# EAGLE design power_node (EAGLE 6.5.0)
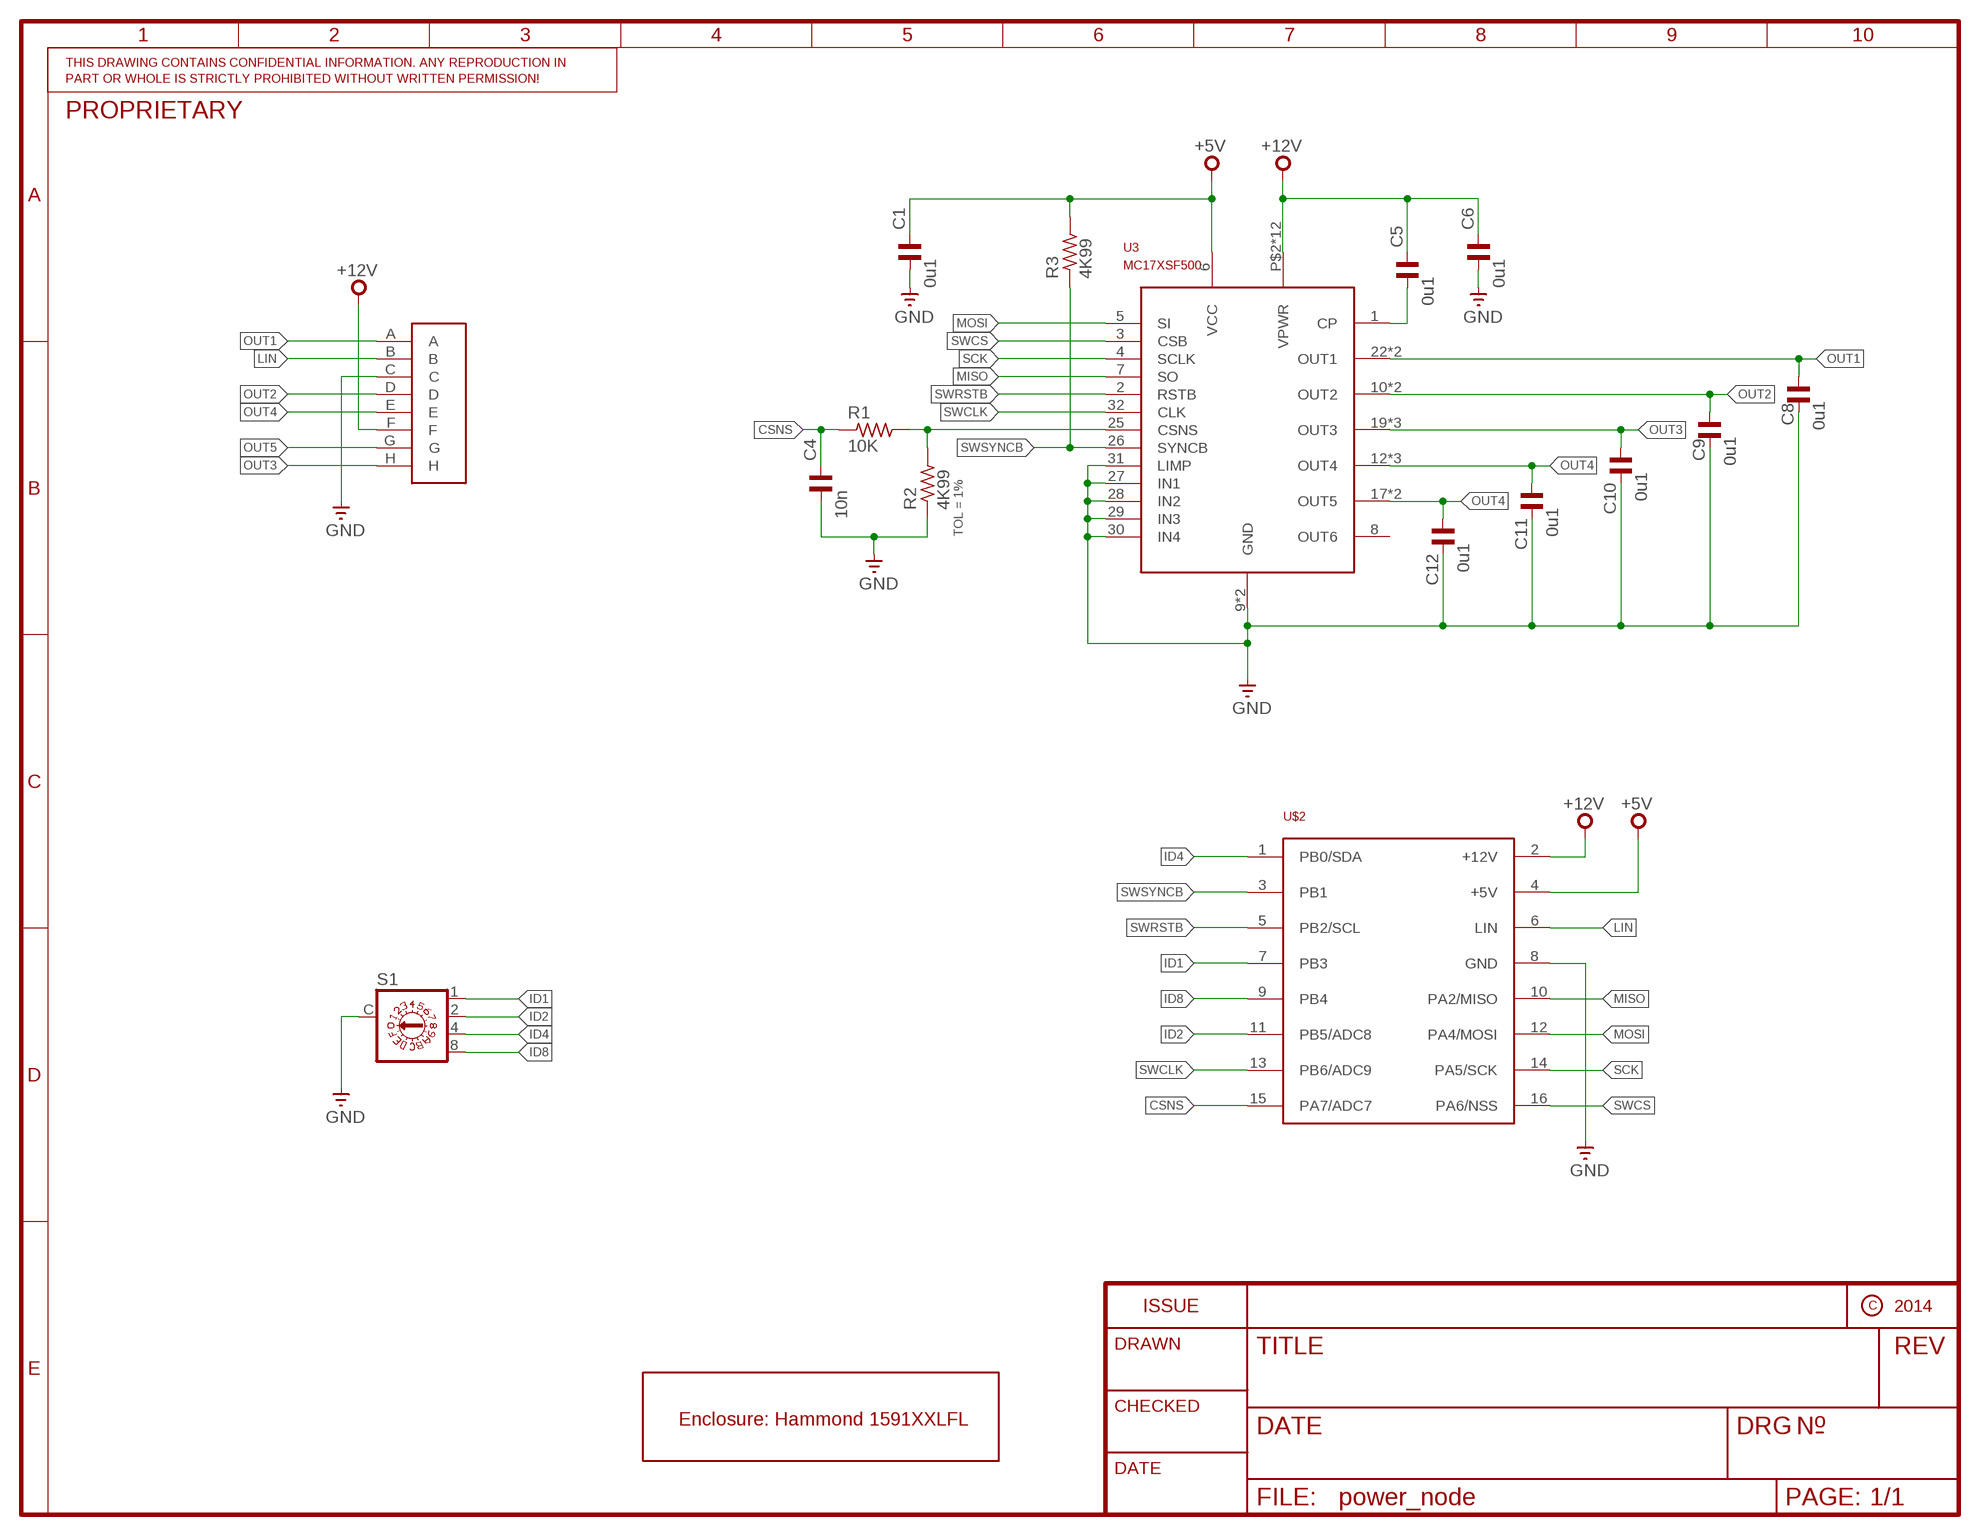
[diagram p0: schematic, sheet 1]

## Parts
C1  0u1  C-EUC0805K  [C0805K]
C4  10n  C-EUC0805K  [C0805K]
C5  0u1  C-EUC0805K  [C0805K]
C6  0u1  C-EUC0805K  [C0805K]
C8  0u1  C-EUC0805K  [C0805K]
C9  0u1  C-EUC0805K  [C0805K]
C10  0u1  C-EUC0805K  [C0805K]
C11  0u1  C-EUC0805K  [C0805K]
C12  0u1  C-EUC0805K  [C0805K]
J2  12146734  [12146734]
R1  10K  R-EU_R0805W  [R0805W]
R2  4K99  R-EU_R0805W  [R0805W]
R3  4K99  R-EU_R0805W  [R0805W]
S1  P103  [P103]
U3  MC17XSF500  [SOIC32W-EP]
U$1  1591XXLFL  [1591XXLFL]
U$2  LIN_NODEHORIZ  [LIN_NODE]

## Nets
+5V [power]: C1.1 R3.2 U3.6(VCC) U$2.4(+5V)
+12V [power]: C5.1 C6.1 J2.F U3.P$2(VPWR) U3.P$3(VPWR) U3.P$4(VPWR) U3.P$5(VPWR) U3.P$6(VPWR) U3.P$7(VPWR) U3.P$8(VPWR) U3.P$9(VPWR) U3.P$10(VPWR) U3.P$11(VPWR) U3.P$12(VPWR) U3.P$13(VPWR) U$2.2(+12V)
CSNS: C4.1 R1.1 U$2.15(PA7/ADC7)
GND [power]: C1.2 C4.2 C6.2 C8.2 C9.2 C10.2 C11.2 C12.2 J2.C R2.1 S1.C U3.9(GND) U3.24(GND) U3.27(IN1) U3.28(IN2) U3.29(IN3) U3.30(IN4) U3.31(LIMP) U$2.8(GND)
ID1: S1.1 U$2.7(PB3)
ID2: S1.2 U$2.11(PB5/ADC8)
ID4: S1.4 U$2.1(PB0/SDA)
ID8: S1.8 U$2.9(PB4)
LIN: J2.B U$2.6(LIN)
MISO: U3.7(SO) U$2.10(PA2/MISO)
MOSI: U3.5(SI) U$2.12(PA4/MOSI)
N$1: C5.2 U3.1(CP)
N$6: R1.2 R2.2 U3.25(CSNS)
OUT1: C8.1 J2.A U3.22(OUT1) U3.23(OUT1)
OUT2: C9.1 J2.D U3.10(OUT2) U3.11(OUT2)
OUT3: C10.1 J2.H U3.19(OUT3) U3.20(OUT3) U3.21(OUT3)
OUT4: C11.1 J2.E U3.12(OUT4) U3.13(OUT4) U3.14(OUT4)
OUT5: C12.1 J2.G U3.17(OUT5) U3.18(OUT5)
SCK: U3.4(SCLK) U$2.14(PA5/SCK)
SWCLK: U3.32(CLK) U$2.13(PB6/ADC9)
SWCS: U3.3(CSB) U$2.16(PA6/NSS)
SWRSTB: U3.2(RSTB) U$2.5(PB2/SCL)
SWSYNCB: R3.1 U3.26(SYNCB) U$2.3(PB1)
Unconnected: U3.8(OUT6)

## Library data of the parts
C1 C5 C6 = custom:C-EU: CAPACITOR, European symbol; PARTNO: FK28X7R1H104K
C4 = custom:C-EU: CAPACITOR, European symbol; PARTNO: FK18X7R1H103K
C8-C12 = custom:C-EU: CAPACITOR, European symbol; PARTNO: C1608X7R1H104M080AA
J2 = custom:12146734; PARTNO: 12146724-B
R1 = custom:R-EU_: RESISTOR, European symbol; PARTNO: CF14JT10K0
R2 = custom:R-EU_: RESISTOR, European symbol; PARTNO: MFR-25FBF52-4K99; TOL: 1%
R3 = custom:R-EU_: RESISTOR, European symbol; PARTNO: MFR-25FBF52-4K99
S1 = custom:P103: DIL/CODE SWITCH; PARTNO: SH-7050MC
U3 = custom:MC17XSF500; PARTNO: MC17XSF500EK
U$1 = custom:1591XXLFL; PARTNO: 1591XXLFLBK
U$2 = custom:LIN_NODE

## Net classes
0 default: width 0.305 mm
1 power: width 0.406 mm

## Board
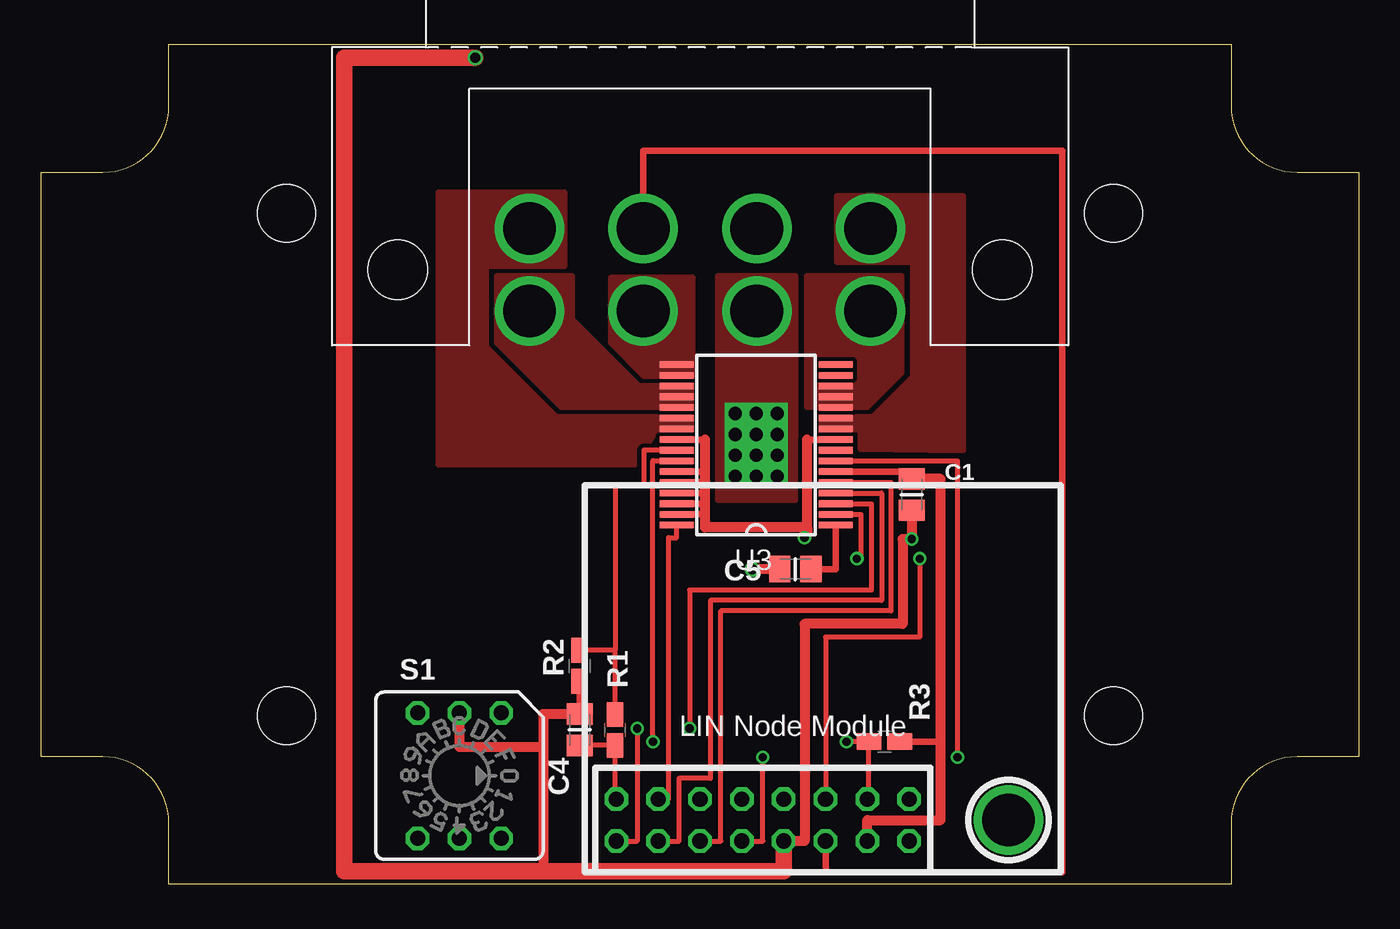
[diagram p1: board, top side]
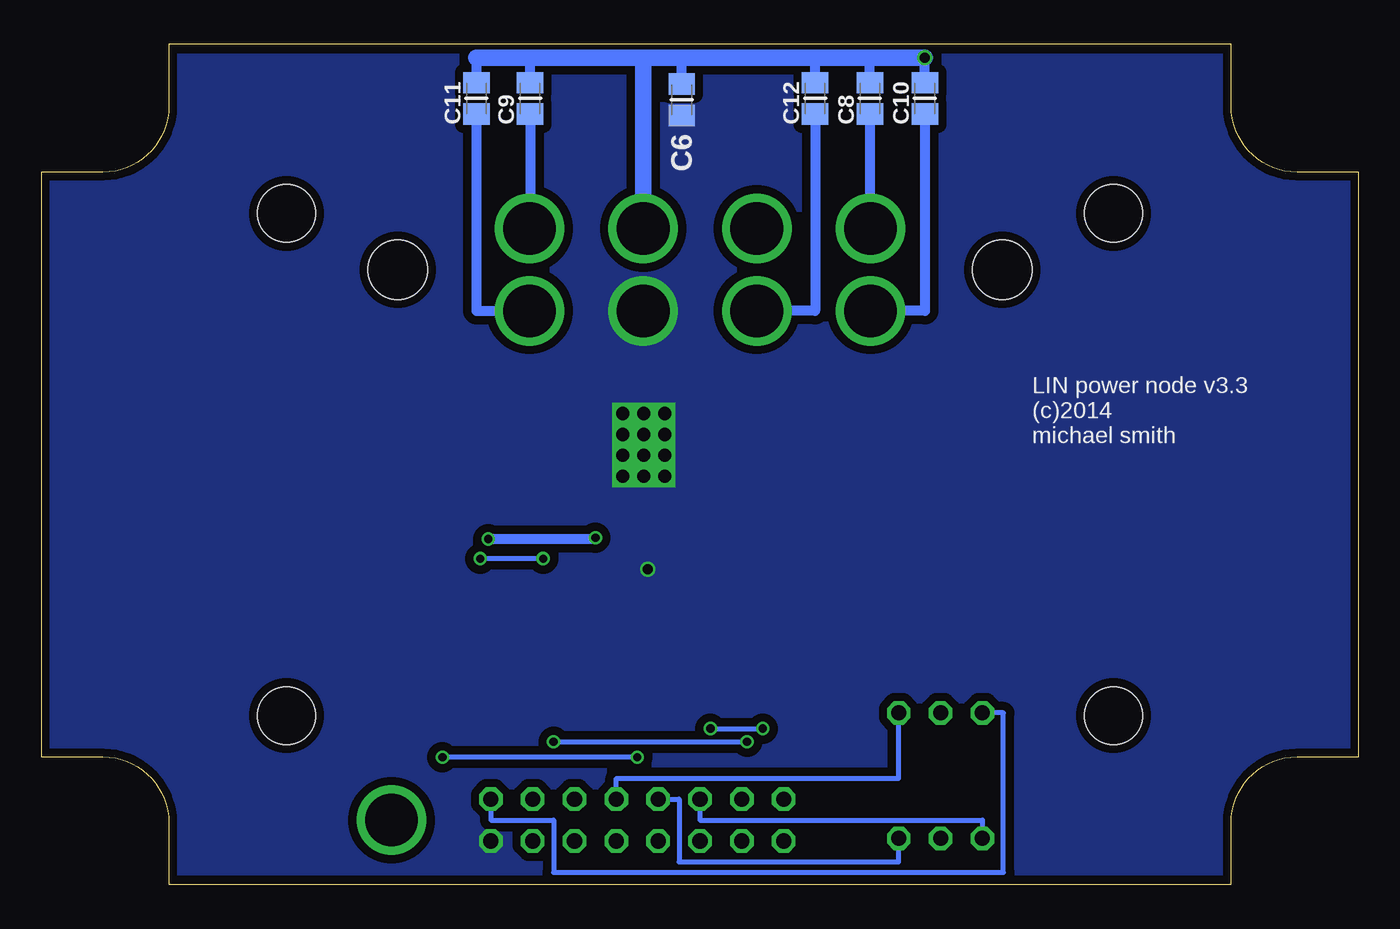
[diagram p2: board, bottom side, seen from below]

Size 80 x 51 mm. Coordinates in mm from the lower left corner, seen from the top.
Copper layers (1*16): Top 0.035mm / dielectric 1.5mm / Bottom 0.035mm
Design rules "dirt_cheap_dirty_boards.v1": minimum track width 5mil, minimum drill 12mil, track to track 5mil, track to pad 5mil, pad to pad 5mil, via to via 5mil, smd to smd 0mil, copper to edge 10mil, drill to drill 10mil, minimum pad ring 10mil, minimum via ring 6mil, stop-mask expansion 2mil, vias tented up to drill 25mil, thermal gap 10mil

### Footprints (pad centres in the part's own frame; a part is rotated, then mirrored left to right if it is on the bottom)
C0805K = smd 1.3 x 1.6: 1 -0.953,0; 2 0.953,0
12146734 = drill 3.2: A 10.35,-2.5; B 3.45,-2.5; C -3.45,-2.5; D -10.35,-2.5; E -10.35,2.5; F -3.45,2.5; G 3.45,2.5; H 10.35,2.5 | hole 3.6: 18.35,0; -18.35,0
R0805W = smd 1.5 x 1: 1 -0.94,0; 2 0.94,0
P103 = drill 0.914 octagon: 1 3.81,-2.54; 2 -3.81,2.54; 4 3.81,2.54; 8 -3.81,-2.54; C 3.81,0; C1 -3.81,0
SOIC32W-EP = smd 2.05 x 0.4: 1 -4.825,4.875; 2 -4.825,4.225; 3 -4.825,3.575; 4 -4.825,2.925; 5 -4.825,2.275; 6 -4.825,1.625; 7 -4.825,0.975; 8 -4.825,0.325; 9 -4.825,-0.325; 10 -4.825,-0.975; 11 -4.825,-1.625; 12 -4.825,-2.275; 13 -4.825,-2.925; 14 -4.825,-3.575; 15 -4.825,-4.225; 16 -4.825,-4.875; 17 4.825,-4.875; 18 4.825,-4.225; 19 4.825,-3.575; 20 4.825,-2.925; 21 4.825,-2.275; 22 4.825,-1.625; 23 4.825,-0.975; 24 4.825,-0.325; 25 4.825,0.325; 26 4.825,0.975; 27 4.825,1.625; 28 4.825,2.275; 29 4.825,2.925; 30 4.825,3.575; 31 4.825,4.225; 32 4.825,4.875 | drill 0.8 square: P$2 1.27,1.905; P$3 0,1.905; P$4 -1.27,1.905; P$5 1.27,0.635; P$6 0,0.635; P$7 -1.27,0.635; P$8 1.27,-0.635; P$9 0,-0.635; P$10 -1.27,-0.635; P$11 1.27,-1.905; P$12 0,-1.905; P$13 -1.27,-1.905
1591XXLFL = hole 3.5: -25.1,15.25; 25.1,15.25; -25.1,-15.25; 25.1,-15.25
LIN_NODE = drill 0.914 octagon: 1 19.685,4.445; 2 19.685,1.905; 3 17.145,4.445; 4 17.145,1.905; 5 14.605,4.445; 6 14.605,1.905; 7 12.065,4.445; 8 12.065,1.905; 9 9.525,4.445; 10 9.525,1.905; 11 6.985,4.445; 12 6.985,1.905; 13 4.445,4.445; 14 4.445,1.905; 15 1.905,4.445; 16 1.905,1.905 | drill 3.2: MTG 25.718,3.175

### Placement (x,y rotation side)
C1  52.86,23.67 270 top
C4  32.7,9.39 90 top
C5  45.79,19.15 0 top
C6  41.11,47.65 90 bottom
C8  29.68,47.73 90 bottom
C9  50.32,47.73 90 bottom
C10  26.35,47.73 90 bottom
C11  53.57,47.73 90 bottom
C12  33.02,47.73 90 bottom
J2  40,37.33 180 top
R1  34.84,9.39 90 top
R2  32.7,13.28 90 top
R3  51.19,8.67 0 top
S1  25.4,6.61 90 top
U3  43.41,26.69 180 top
U$1  40,25.5 0 top
U$2  33.02,0.73 0 top

### Tracks (layer width: path | path; a pad name or v marks a point on that pad's centre or on a via)
+5V
  Top 0.406: U3.6 52.86,25.07 C1.1 | R3.2 54.6,8.67
  Top 0.61: U$2.4 50.16,3.91 54.6,3.91 54.6,8.67 54.6,24.63 C1.1
+12V  (via drill 0.6)
  Top 0.61: C5.1 v43.17,19.15
  pour Top (isolate 0.254, no thermals): 41.11,23.36 45.79,23.36 45.79,36.93 41.11,36.93
  pour Bottom (isolate 0.508, no thermals): 0.63,0.73 79.37,0.73 79.37,50.27 0.63,50.27
CSNS
  Top 0.305: U$2.15 34.84,5.18 R1.1 32.7,8.45 C4.1
GND  (via drill 0.5, 0.6)
  Top 0.406: U3.24 40.32,27.02 40.32,26.77 | U3.27 40.32,25.07 40.32,24.87 | U3.28 40.32,24.42 40.32,24.23 | U3.29 40.32,23.77 40.32,23.59 | U3.30 40.32,23.12 40.32,22.96 | U3.31 40.32,22.47 40.32,22.33 | U3.9 46.51,27.02 46.51,27.01 | C4.2 R2.1
  Top 0.61: 46.35,21.69 v46.35,21.05 46.51,21.21 46.51,21.69 | 46.35,21.69 40.32,21.69 40.32,22.33 40.32,22.96 40.32,23.59 40.32,24.23 40.32,24.87 40.32,26.77 40.32,27.01 | 46.35,21.69 46.51,21.69 | 46.51,21.69 46.51,27.01 | C1.2 v52.86,20.98 52.3,20.98 52.3,15.82 46.35,15.82 46.35,2.64 U$2.8 | C4.2 30.48,10.34 30.48,8.36 | 30.48,8.36 30.48,0.81 | S1.C 25.4,8.36 30.48,8.36
  Top 1.016: U$2.8 45.08,0.81 30.48,0.81 18.41,0.81 18.41,50.19 v26.35,50.19
  Bottom 0.61: 53.57,50.19 C11.2 | C10.2 v26.35,50.19 | C8.2 29.68,50.19 | C12.2 33.02,50.19 | C9.2 50.32,50.19 | C6.2 41.11,50.19 | v46.35,21.05 46.35,20.98 v52.86,20.98
  Bottom 1.016: v26.35,50.19 29.68,50.19 33.02,50.19 41.11,50.19 43.45,50.19 | 43.45,50.19 50.32,50.19 53.57,50.19 | J2.C 43.45,50.19
ID1
  Bottom 0.305: U$2.7 45.08,6.45 27.94,6.45 S1.1
ID2
  Bottom 0.305: U$2.11 40,3.91 22.86,3.91 S1.2
ID4
  Bottom 0.305: U$2.1 52.7,3.91 48.89,3.91 48.89,0.73 21.59,0.73 21.59,10.42 S1.4
ID8
  Bottom 0.305: U$2.9 41.27,5.18 41.27,1.37 27.94,1.37 S1.8
LIN
  Top 0.406: U$2.6 47.62,0.73 61.99,0.73 61.99,44.55 36.55,44.55 J2.B
MISO  (via drill 0.5)
  Top 0.305: U3.7 55.64,25.72 v55.64,7.72 | U$2.10 43.81,2.64 v43.81,7.72
  Bottom 0.305: v43.81,7.72 v55.64,7.72
MOSI
  Top 0.305: U3.5 51.59,24.42 51.59,16.61 41.27,16.61 41.27,2.64 U$2.12
N$1
  Top 0.406: U3.1 48.24,19.15 C5.2
N$6
  Top 0.305: U3.25 36.59,26.37 36.59,24.23 34.84,24.23 34.84,14.22 | R1.2 34.84,14.22 | 34.84,14.22 R2.2
OUT1
  Bottom 0.61: C8.1 29.68,39.83 J2.A
  pour Top (isolate 0.254, no thermals): 31.74,42.01 24.12,42.01 24.12,25.5 36.03,25.5 37.3,27.56 39.44,27.56 39.44,28.36 31.27,28.36 26.98,32.64 26.98,37.56 31.74,37.56
OUT2
  Bottom 0.61: C9.1 50.32,39.83 J2.D
  pour Top (isolate 0.254, no thermals): 47.38,28.36 50.48,28.36 52.94,30.82 52.94,37.8 48.33,37.8 48.33,41.77 55.95,41.77 55.95,26.37 49.76,26.45 49.76,27.64 47.38,27.64
OUT3
  Bottom 0.61: C10.1 26.35,34.83 J2.H
  pour Top (isolate 0.254, no thermals): 39.44,30.26 36.27,30.26 32.22,34.31 32.22,36.93 27.7,36.93 27.7,32.88 31.59,28.99 39.44,28.99
OUT4
  Bottom 0.61: C11.1 53.57,34.83 J2.E
  pour Top (isolate 0.254, no thermals): 52.22,36.93 52.22,31.06 50.16,28.99 46.51,28.99 46.51,36.93
OUT5
  Bottom 0.61: C12.1 33.02,34.83 J2.G
  pour Top (isolate 0.254, no thermals): 34.6,36.85 34.6,32.88 36.59,30.9 39.52,30.9 39.52,36.85
SCK
  Top 0.305: U3.4 51.03,23.77 51.03,17.25 40.63,17.25 40.63,6.45 38.73,6.45 38.73,2.64 U$2.14
SWCLK
  Top 0.305: U$2.13 38.09,5.18 38.09,21.05 38.59,21.05 U3.32
SWCS  (via drill 0.5)
  Top 0.305: U3.3 50.4,23.12 50.4,17.88 39.37,17.88 v39.37,9.47 | U$2.16 36.19,2.64 v36.19,9.47
  Bottom 0.305: v39.37,9.47 v36.19,9.47
SWRSTB  (via drill 0.5)
  Top 0.305: U3.2 49.76,22.47 49.76,19.79 v49.52,19.79 | v53.34,19.79 53.34,15.02 47.62,15.02 U$2.5
  Bottom 0.305: v49.52,19.79 v53.34,19.79
SWSYNCB  (via drill 0.5)
  Top 0.305: U$2.3 50.25,5.18 R3.1 v48.89,8.67 | v37.14,8.67 37.14,25.74 38.59,25.74 U3.26
  Bottom 0.305: v48.89,8.67 v37.14,8.67

### Text on the board
bNames: LIN power node v3.3 / (c)2014 / michael smith